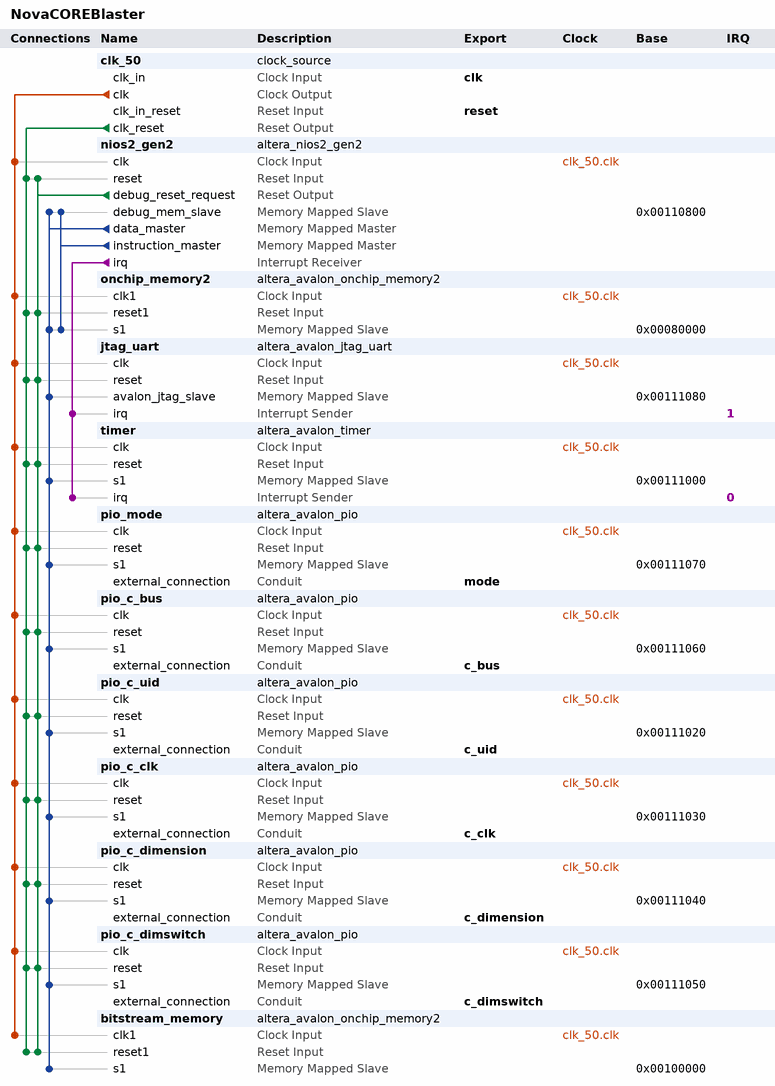
[diagram p0: system contents]
# Platform Designer (Qsys) system NovaCOREBlaster, Stratix IV EP4SGX230KF40C2ES
# Parameters at their usual value, and those the tool derives, are not listed.
package require -exact qsys 14.1
create_system NovaCOREBlaster
set_project_property DEVICE_FAMILY {Stratix IV}
set_project_property DEVICE EP4SGX230KF40C2ES

add_instance clk_50 clock_source 14.1
set_instance_parameter_value clk_50 clockFrequency 50000000

add_instance nios2_gen2 altera_nios2_gen2 14.1
set_instance_parameter_value nios2_gen2 dcache_size 2048
set_instance_parameter_value nios2_gen2 exceptionSlave onchip_memory2.s1
set_instance_parameter_value nios2_gen2 icache_size 4096
set_instance_parameter_value nios2_gen2 impl Tiny
set_instance_parameter_value nios2_gen2 resetSlave onchip_memory2.s1

add_instance onchip_memory2 altera_avalon_onchip_memory2 14.1
set_instance_parameter_value onchip_memory2 dataWidth 32
set_instance_parameter_value onchip_memory2 dualPort false
set_instance_parameter_value onchip_memory2 initMemContent true
set_instance_parameter_value onchip_memory2 initializationFileName onchip_mem.hex
set_instance_parameter_value onchip_memory2 memorySize 262144

add_instance jtag_uart altera_avalon_jtag_uart 14.1
set_instance_parameter_value jtag_uart simInteractiveOptions NO_INTERACTIVE_WINDOWS

add_instance timer altera_avalon_timer 14.1
set_instance_parameter_value timer period 1
set_instance_parameter_value timer periodUnits MSEC

add_instance pio_mode altera_avalon_pio 14.1
set_instance_parameter_value pio_mode direction Output
set_instance_parameter_value pio_mode resetValue 1
set_instance_parameter_value pio_mode width 1

add_instance pio_c_bus altera_avalon_pio 14.1
set_instance_parameter_value pio_c_bus direction Output
set_instance_parameter_value pio_c_bus width 28

add_instance pio_c_uid altera_avalon_pio 14.1
set_instance_parameter_value pio_c_uid direction Output
set_instance_parameter_value pio_c_uid width 4

add_instance pio_c_clk altera_avalon_pio 14.1
set_instance_parameter_value pio_c_clk direction Output
set_instance_parameter_value pio_c_clk width 1

add_instance pio_c_dimension altera_avalon_pio 14.1
set_instance_parameter_value pio_c_dimension direction Output
set_instance_parameter_value pio_c_dimension width 4

add_instance pio_c_dimswitch altera_avalon_pio 14.1
set_instance_parameter_value pio_c_dimswitch direction Output
set_instance_parameter_value pio_c_dimswitch width 1

add_instance bitstream_memory altera_avalon_onchip_memory2 14.1
set_instance_parameter_value bitstream_memory dataWidth 32
set_instance_parameter_value bitstream_memory dualPort false
set_instance_parameter_value bitstream_memory initMemContent true
set_instance_parameter_value bitstream_memory initializationFileName bitstream.hex
set_instance_parameter_value bitstream_memory memorySize 65536
set_instance_parameter_value bitstream_memory useNonDefaultInitFile true

# connections
add_connection clk_50.clk bitstream_memory.clk1 clock
add_connection clk_50.clk jtag_uart.clk clock
add_connection clk_50.clk nios2_gen2.clk clock
add_connection clk_50.clk onchip_memory2.clk1 clock
add_connection clk_50.clk pio_c_bus.clk clock
add_connection clk_50.clk pio_c_clk.clk clock
add_connection clk_50.clk pio_c_dimension.clk clock
add_connection clk_50.clk pio_c_dimswitch.clk clock
add_connection clk_50.clk pio_c_uid.clk clock
add_connection clk_50.clk pio_mode.clk clock
add_connection clk_50.clk timer.clk clock
add_connection clk_50.clk_reset bitstream_memory.reset1 reset
add_connection clk_50.clk_reset jtag_uart.reset reset
add_connection clk_50.clk_reset nios2_gen2.reset reset
add_connection clk_50.clk_reset onchip_memory2.reset1 reset
add_connection clk_50.clk_reset pio_c_bus.reset reset
add_connection clk_50.clk_reset pio_c_clk.reset reset
add_connection clk_50.clk_reset pio_c_dimension.reset reset
add_connection clk_50.clk_reset pio_c_dimswitch.reset reset
add_connection clk_50.clk_reset pio_c_uid.reset reset
add_connection clk_50.clk_reset pio_mode.reset reset
add_connection clk_50.clk_reset timer.reset reset
add_connection nios2_gen2.debug_reset_request bitstream_memory.reset1 reset
add_connection nios2_gen2.debug_reset_request jtag_uart.reset reset
add_connection nios2_gen2.debug_reset_request nios2_gen2.reset reset
add_connection nios2_gen2.debug_reset_request onchip_memory2.reset1 reset
add_connection nios2_gen2.debug_reset_request pio_c_bus.reset reset
add_connection nios2_gen2.debug_reset_request pio_c_clk.reset reset
add_connection nios2_gen2.debug_reset_request pio_c_dimension.reset reset
add_connection nios2_gen2.debug_reset_request pio_c_dimswitch.reset reset
add_connection nios2_gen2.debug_reset_request pio_c_uid.reset reset
add_connection nios2_gen2.debug_reset_request pio_mode.reset reset
add_connection nios2_gen2.debug_reset_request timer.reset reset
add_connection nios2_gen2.data_master bitstream_memory.s1 avalon
set_connection_parameter_value nios2_gen2.data_master/bitstream_memory.s1 baseAddress 0x00100000
add_connection nios2_gen2.data_master jtag_uart.avalon_jtag_slave avalon
set_connection_parameter_value nios2_gen2.data_master/jtag_uart.avalon_jtag_slave baseAddress 0x00111080
add_connection nios2_gen2.data_master nios2_gen2.debug_mem_slave avalon
set_connection_parameter_value nios2_gen2.data_master/nios2_gen2.debug_mem_slave baseAddress 0x00110800
add_connection nios2_gen2.data_master onchip_memory2.s1 avalon
set_connection_parameter_value nios2_gen2.data_master/onchip_memory2.s1 baseAddress 0x00080000
add_connection nios2_gen2.data_master pio_c_bus.s1 avalon
set_connection_parameter_value nios2_gen2.data_master/pio_c_bus.s1 baseAddress 0x00111060
add_connection nios2_gen2.data_master pio_c_clk.s1 avalon
set_connection_parameter_value nios2_gen2.data_master/pio_c_clk.s1 baseAddress 0x00111030
add_connection nios2_gen2.data_master pio_c_dimension.s1 avalon
set_connection_parameter_value nios2_gen2.data_master/pio_c_dimension.s1 baseAddress 0x00111040
add_connection nios2_gen2.data_master pio_c_dimswitch.s1 avalon
set_connection_parameter_value nios2_gen2.data_master/pio_c_dimswitch.s1 baseAddress 0x00111050
add_connection nios2_gen2.data_master pio_c_uid.s1 avalon
set_connection_parameter_value nios2_gen2.data_master/pio_c_uid.s1 baseAddress 0x00111020
add_connection nios2_gen2.data_master pio_mode.s1 avalon
set_connection_parameter_value nios2_gen2.data_master/pio_mode.s1 baseAddress 0x00111070
add_connection nios2_gen2.data_master timer.s1 avalon
set_connection_parameter_value nios2_gen2.data_master/timer.s1 baseAddress 0x00111000
add_connection nios2_gen2.instruction_master nios2_gen2.debug_mem_slave avalon
set_connection_parameter_value nios2_gen2.instruction_master/nios2_gen2.debug_mem_slave baseAddress 0x00110800
add_connection nios2_gen2.instruction_master onchip_memory2.s1 avalon
set_connection_parameter_value nios2_gen2.instruction_master/onchip_memory2.s1 baseAddress 0x00080000
add_connection nios2_gen2.irq jtag_uart.irq interrupt
set_connection_parameter_value nios2_gen2.irq/jtag_uart.irq irqNumber 1
add_connection nios2_gen2.irq timer.irq interrupt
set_connection_parameter_value nios2_gen2.irq/timer.irq irqNumber 0

# exported interfaces
add_interface c_bus conduit end
set_interface_property c_bus EXPORT_OF pio_c_bus.external_connection
add_interface c_clk conduit end
set_interface_property c_clk EXPORT_OF pio_c_clk.external_connection
add_interface c_dimension conduit end
set_interface_property c_dimension EXPORT_OF pio_c_dimension.external_connection
add_interface c_dimswitch conduit end
set_interface_property c_dimswitch EXPORT_OF pio_c_dimswitch.external_connection
add_interface c_uid conduit end
set_interface_property c_uid EXPORT_OF pio_c_uid.external_connection
add_interface clk clock sink
set_interface_property clk EXPORT_OF clk_50.clk_in
add_interface mode conduit end
set_interface_property mode EXPORT_OF pio_mode.external_connection
add_interface reset reset sink
set_interface_property reset EXPORT_OF clk_50.clk_in_reset

set_interconnect_requirement {$system} qsys_mm.clockCrossingAdapter HANDSHAKE
set_interconnect_requirement {$system} qsys_mm.insertDefaultSlave FALSE
set_interconnect_requirement {$system} qsys_mm.maxAdditionalLatency 1

save_system NovaCOREBlaster.qsys
